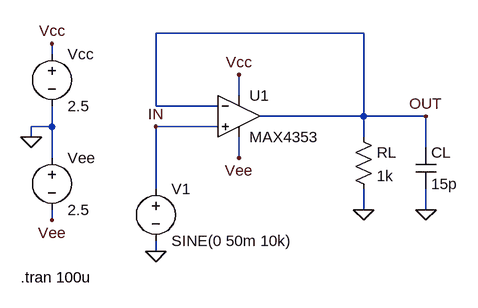
[diagram p0: schematic MAX4353.asc]
MAX4353.asc, the LTspice schematic file:
Version 4
SHEET 1 1720 800
WIRE 624 256 304 256
WIRE 144 288 144 272
WIRE 432 352 432 320
WIRE 304 368 304 256
WIRE 400 368 304 368
WIRE 624 384 624 256
WIRE 624 384 464 384
WIRE 720 384 624 384
WIRE 144 400 144 368
WIRE 144 400 112 400
WIRE 400 400 304 400
WIRE 112 416 112 400
WIRE 624 416 624 384
WIRE 720 432 720 384
WIRE 144 448 144 400
WIRE 432 448 432 416
WIRE 304 496 304 400
WIRE 624 528 624 496
WIRE 720 528 720 496
WIRE 144 544 144 528
WIRE 304 592 304 576
FLAG 720 384 OUT
FLAG 144 272 Vcc
FLAG 144 544 Vee
FLAG 432 320 Vcc
FLAG 432 448 Vee
FLAG 112 416 0
FLAG 304 592 0
FLAG 624 528 0
FLAG 304 400 IN
FLAG 720 528 0
SYMBOL voltage 144 432 R0
WINDOW 123 0 0 Left 2
SYMATTR InstName Vee
SYMATTR Value 2.5
SYMBOL voltage 144 272 R0
WINDOW 123 0 0 Left 2
SYMATTR InstName Vcc
SYMATTR Value 2.5
SYMBOL res 608 400 R0
SYMATTR InstName RL
SYMATTR Value 1k
SYMBOL voltage 304 480 R0
WINDOW 123 0 0 Left 0
WINDOW 39 0 0 Left 0
SYMATTR InstName V1
SYMATTR Value SINE(0 50m 10k)
SYMBOL cap 704 432 R0
SYMATTR InstName CL
SYMATTR Value 15p
SYMBOL MAX4353 432 320 R0
SYMATTR InstName U1
TEXT 96 632 Left 2 !.tran 100u

The netlist it stands for:
* MAX4353.asc
Vee 0 Vee 2.5
Vcc Vcc 0 2.5
RL OUT 0 1k
V1 IN 0 SINE(0 50m 10k)
CL OUT 0 15p
* U1: MAX4353 (symbol MAX4353 not available, pins judged from their places): In+=IN In-=OUT V+=Vcc V-=Vee OUT=OUT
.tran 100u
.backanno
.end